# EAGLE schematic drive (EAGLE 5.12)
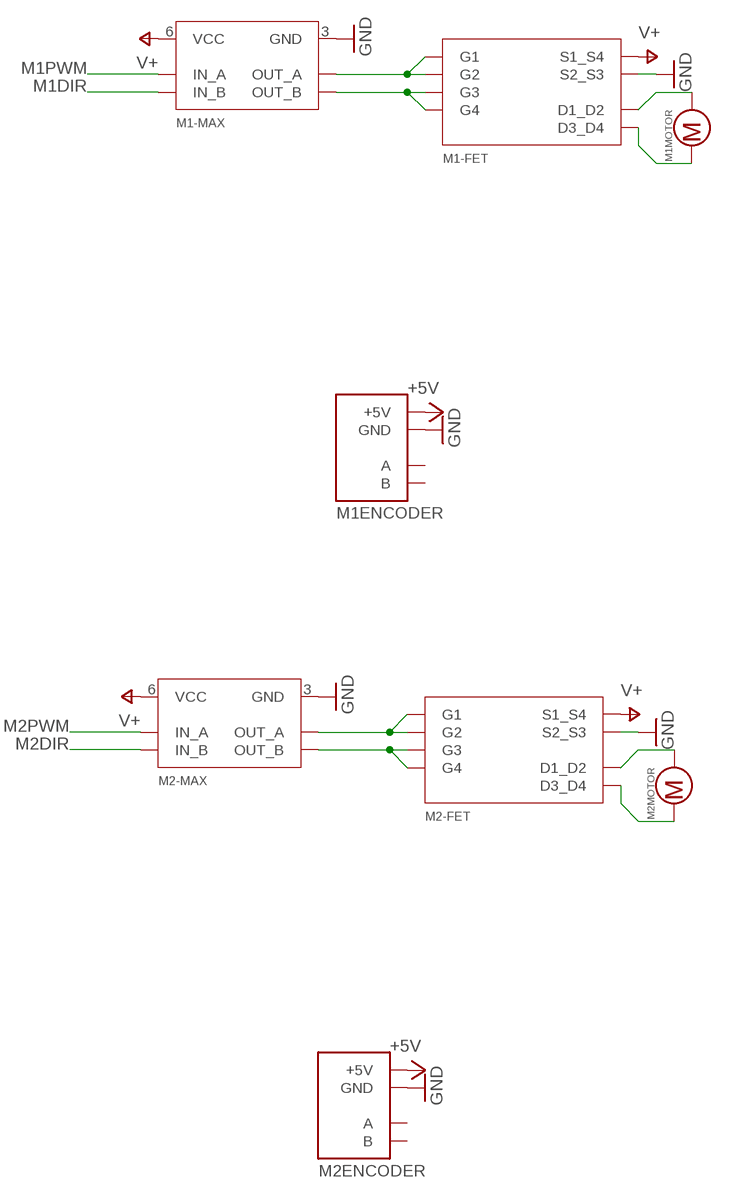
[diagram p0: schematic, sheet 1]

## Parts
M1  FAULHABER-1524INLINE  [53047-06]
M1-FET  ZXMHC3A01T8  [SM8]
M1-MAX  MAX4427CSA  [SO08]
M2  FAULHABER-1524INLINE  [53047-06]
M2-FET  ZXMHC3A01T8  [SM8]
M2-MAX  MAX4427CSA  [SO08]

## Nets
+5V: M1.4(ENCODER:+5V) M2.4(ENCODER:+5V)
GND: M1-FET.2(S2_S3) M1-MAX.3(GND) M1.3(ENCODER:GND) M2-FET.2(S2_S3) M2-MAX.3(GND) M2.3(ENCODER:GND)
M1-OUTA: M1-FET.3(G2) M1-FET.4(G1) M1-MAX.7(OUT_A)
M1-OUTB: M1-FET.1(G3) M1-FET.8(G4) M1-MAX.5(OUT_B)
M1DIR: M1-MAX.4(IN_B)
M1PWM: M1-MAX.2(IN_A)
M2DIR: M2-MAX.4(IN_B)
M2PWM: M2-MAX.2(IN_A)
N$3: M1-FET.5(D1_D2) M1.1(MOTOR:+)
N$4: M1-FET.7(D3_D4) M1.2(MOTOR:-)
N$5: M2-FET.3(G2) M2-FET.4(G1) M2-MAX.7(OUT_A)
N$6: M2-FET.1(G3) M2-FET.8(G4) M2-MAX.5(OUT_B)
N$7: M2-FET.5(D1_D2) M2.1(MOTOR:+)
N$8: M2-FET.7(D3_D4) M2.2(MOTOR:-)
V+: M1-FET.6(S1_S4) M1-MAX.6(VCC) M2-FET.6(S1_S4) M2-MAX.6(VCC)
Unconnected: M1.5(ENCODER:B) M1.6(ENCODER:A) M2.5(ENCODER:B) M2.6(ENCODER:A)

## Library data of the parts
M1 M2 = FaulhaberMotors:FAULHABER-1524
M1-FET M2-FET = r3_parts:ZXMHC3A01T8: COMPLEMENTARY 30V ENHANCEMENT MODE MOSFET H-BRIDGE This new generation of trench MOSFETs from Zetex utilizes a unique structure that combines the benefits of low on-resistance with fast switching speed. This makes them ideal for high efficiency, low voltage, power management applications.
M1-MAX M2-MAX = r3_parts:MAX4427: Dual High-Speed 1.5A MOSFET Driver The MAX4426/MAX4427/MAX4428 are dual monolithic MOSFET drivers designed to translate TTL/CMOS inputs to high voltage/current outputs. The MAX4426 is a dual inverting power MOSFET driver. The MAX4427 is a dual noninverting power MOSFET driver, and the MAX4428 contains one inverting section and one noninverting section. Delay times are nearly independent of VDD (see Typical Operating Characteristics). High-current output drivers rapidly charge and discharge the gate capacitance of even the largest power MOSFETs to within millivolts of the supply rails. This produces the power MOSFETs' minimum on resistance. The MAX4426/ MAX4427/MAX4428's high speed minimizes power loss- es in switching power supplies and DC-DC converters.